# EAGLE design minutka_schematic (EAGLE 7.7.0)
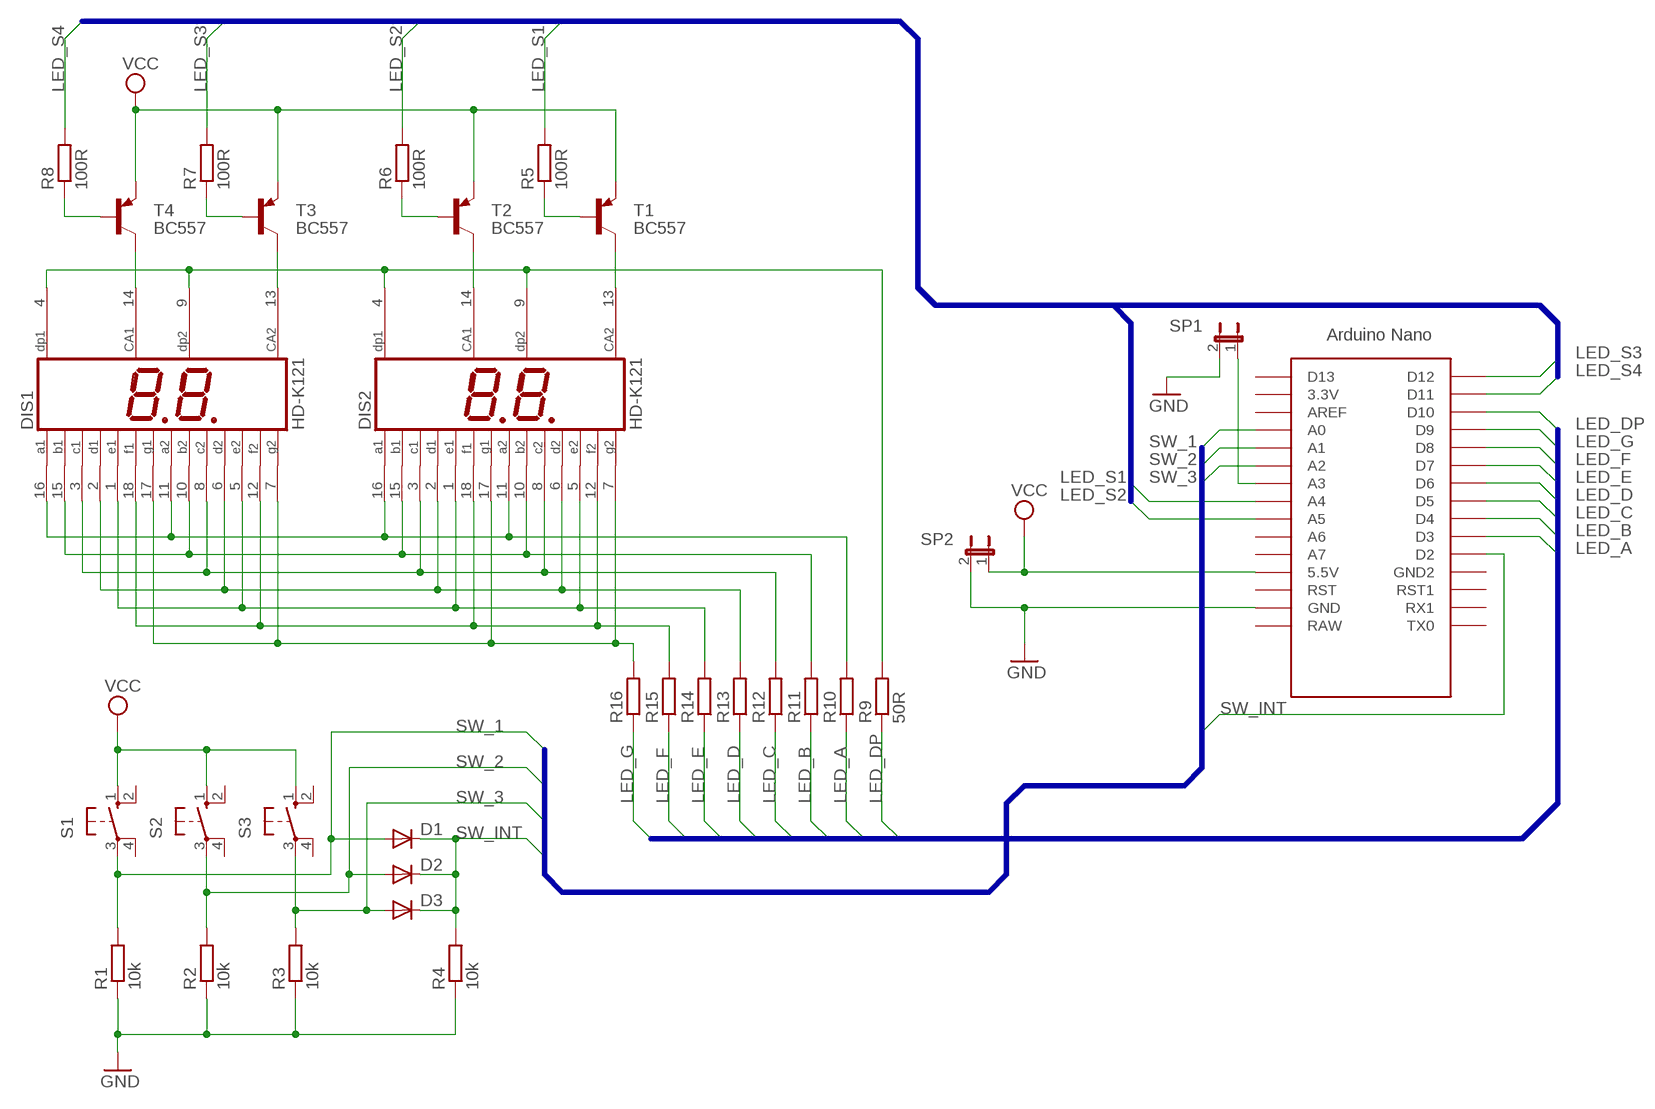
[diagram p0: schematic, sheet 1]

## Parts
D1  DIODE-D-5  [D-5]
D2  DIODE-D-5  [D-5]
D3  DIODE-D-5  [D-5]
DIS1  HD-K121  [HDSP-R]
DIS2  HD-K121  [HDSP-R]
R1  10k  R-EU_0204/7  [0204/7]
R2  10k  R-EU_0204/7  [0204/7]
R3  10k  R-EU_0204/7  [0204/7]
R4  10k  R-EU_0204/7  [0204/7]
R5  100R  R-EU_0204/7  [0204/7]
R6  100R  R-EU_0204/7  [0204/7]
R7  100R  R-EU_0204/7  [0204/7]
R8  100R  R-EU_0204/7  [0204/7]
R9  50R  R-EU_0204/7  [0204/7]
R10  R-EU_0204/7  [0204/7]
R11  R-EU_0204/7  [0204/7]
R12  R-EU_0204/7  [0204/7]
R13  R-EU_0204/7  [0204/7]
R14  R-EU_0204/7  [0204/7]
R15  R-EU_0204/7  [0204/7]
R16  R-EU_0204/7  [0204/7]
S1  10-XX  [B3F-10XX]
S2  10-XX  [B3F-10XX]
S3  10-XX  [B3F-10XX]
SP1  JP1E  [JP1]
SP2  JP1E  [JP1]
T1  BC557  [TO92-EBC]
T2  BC557  [TO92-EBC]
T3  BC557  [TO92-EBC]
T4  BC557  [TO92-EBC]
U$1  NANO  [NANO]

## Nets
GND: R1.1 R2.1 R3.1 R4.1 SP1.2 SP2.2 U$1.GND
LED_A: R10.1 U$1.D3
LED_B: R11.1 U$1.D4
LED_C: R12.1 U$1.D5
LED_D: R13.1 U$1.D6
LED_DP: R9.1 U$1.D10
LED_E: R14.1 U$1.D7
LED_F: R15.1 U$1.D8
LED_G: R16.1 U$1.D9
LED_S1: R5.2 U$1.A4
LED_S2: R6.2 U$1.A5
LED_S3: R7.2 U$1.D12
LED_S4: R8.2 U$1.D11
N$1: DIS1.11(A2) DIS1.16(A1) DIS2.11(A2) DIS2.16(A1) R10.2
N$2: DIS1.10(B2) DIS1.15(B1) DIS2.10(B2) DIS2.15(B1) R11.2
N$3: DIS1.3(C1) DIS1.8(C2) DIS2.3(C1) DIS2.8(C2) R12.2
N$4: DIS1.2(D1) DIS1.6(D2) DIS2.2(D1) DIS2.6(D2) R13.2
N$5: DIS1.1(E1) DIS1.5(E2) DIS2.1(E1) DIS2.5(E2) R14.2
N$6: DIS1.12(F2) DIS1.18(F1) DIS2.12(F2) DIS2.18(F1) R15.2
N$7: DIS1.7(G2) DIS1.17(G1) DIS2.7(G2) DIS2.17(G1) R16.2
N$8: DIS1.4(DP1) DIS1.9(DP2) DIS2.4(DP1) DIS2.9(DP2) R9.2
N$9: DIS2.13(CA2) T1.C
N$10: DIS2.14(CA1) T2.C
N$11: DIS1.13(CA2) T3.C
N$12: DIS1.14(CA1) T4.C
N$13: R7.1 T3.B
N$14: R8.1 T4.B
N$15: R6.1 T2.B
N$16: R5.1 T1.B
N$20: SP1.1 U$1.A3
SW_1: D1.A R1.2 S1.3(P) U$1.A0
SW_2: D2.A R2.2 S2.3(P) U$1.A1
SW_3: D3.A R3.2 S3.3(P) U$1.A2
SW_INT: D1.C D2.C D3.C R4.2 U$1.D2
VCC: S1.1(S) S2.1(S) S3.1(S) SP2.1 T1.E T2.E T3.E T4.E U$1.5V(5.5V)
Unconnected: S1.2(S1) S1.4(P1) S2.2(S1) S2.4(P1) S3.2(S1) S3.4(P1) U$1.3.3V U$1.A6 U$1.A7 U$1.AREF U$1.D13 U$1.GND1(GND2) U$1.ICSP1 U$1.ICSP2 U$1.ICSP3 U$1.ICSP4 U$1.ICSP5 U$1.ICSP6 U$1.RAW U$1.RST U$1.RST1 U$1.RX1 U$1.TX0

## Buses
LED_A,LED_B,LED_C,LED_D,LED_E,LED_F,LED_G,LED_DP
SW_1,SW_2,SW_3,SW_INT
LED_S1,LED_S2,LED_S3,LED_S4

## Library data of the parts
D1-D3 = diode:DIODE-: DIODE
DIS1 DIS2 = display-hp:HD-K121: LED DISPLAY 2 x 1 character 7 segment, decimal points right; OC_FARNELL: unknown; OC_NEWARK: unknown
R1-R16 = rcl:R-EU_: RESISTOR, European symbol
S1-S3 = switch-omron:10-XX: OMRON SWITCH; MPN: B3F-1000; OC_FARNELL: 176432; OC_NEWARK: 36M3542
SP1 SP2 = jumper:JP1E: JUMPER
T1-T4 = transistor-pnp:BC557*: PNP Transistror
U$1 = Arduino-clone:NANO: Arduino Nano

## Board
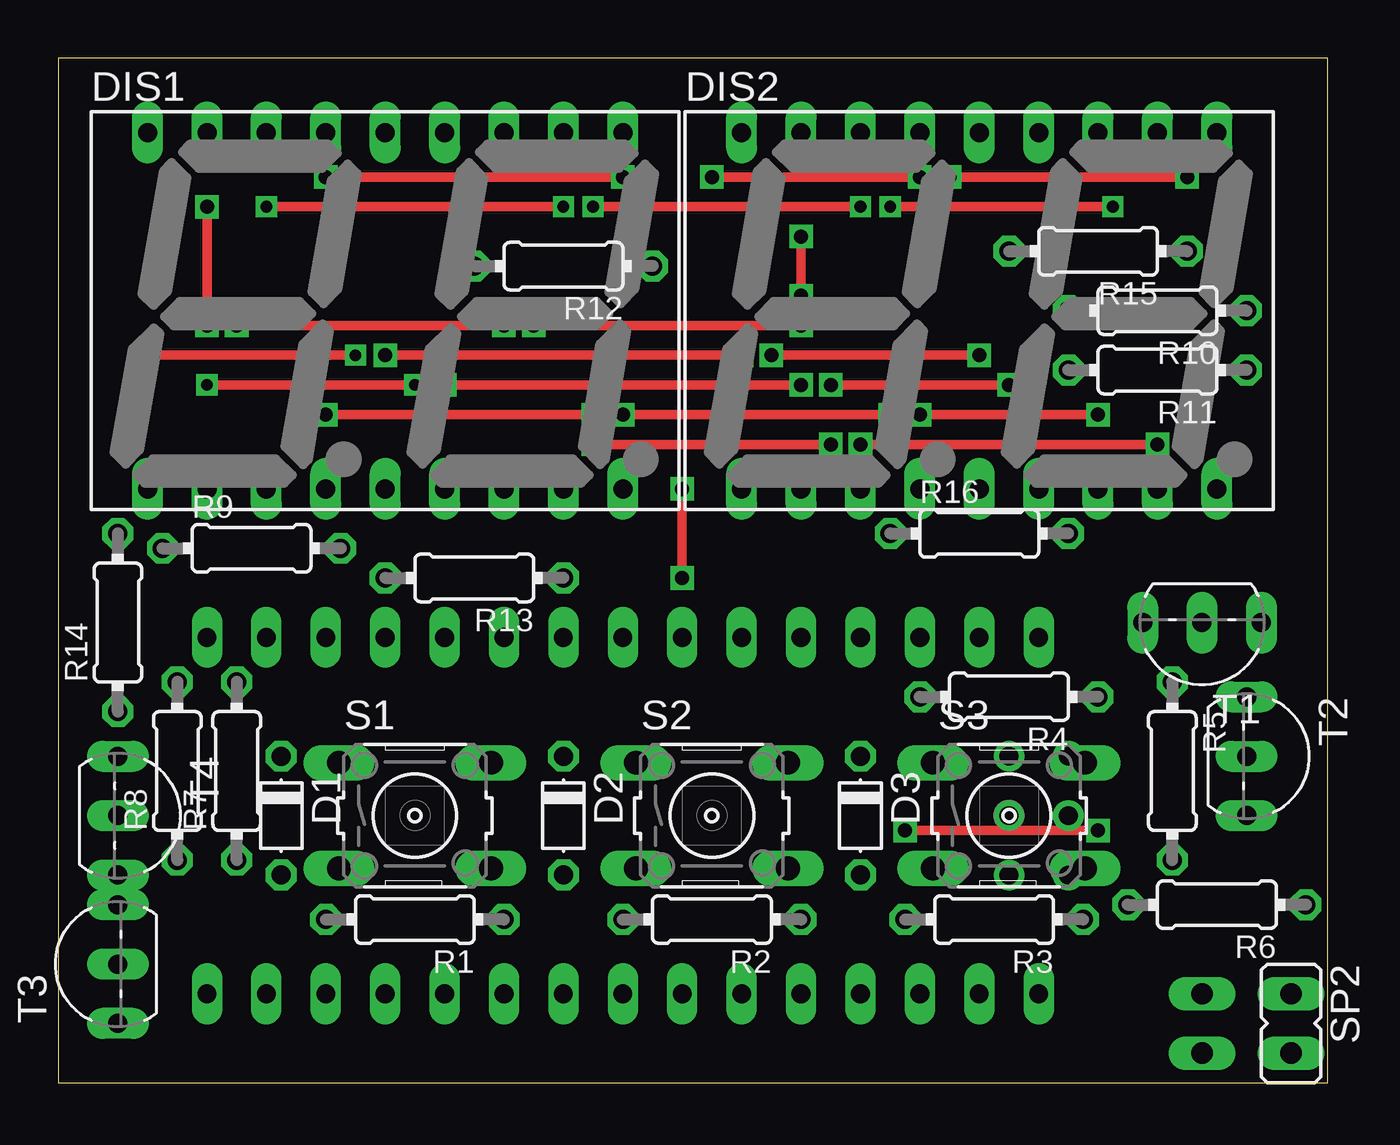
[diagram p1: board, top side]
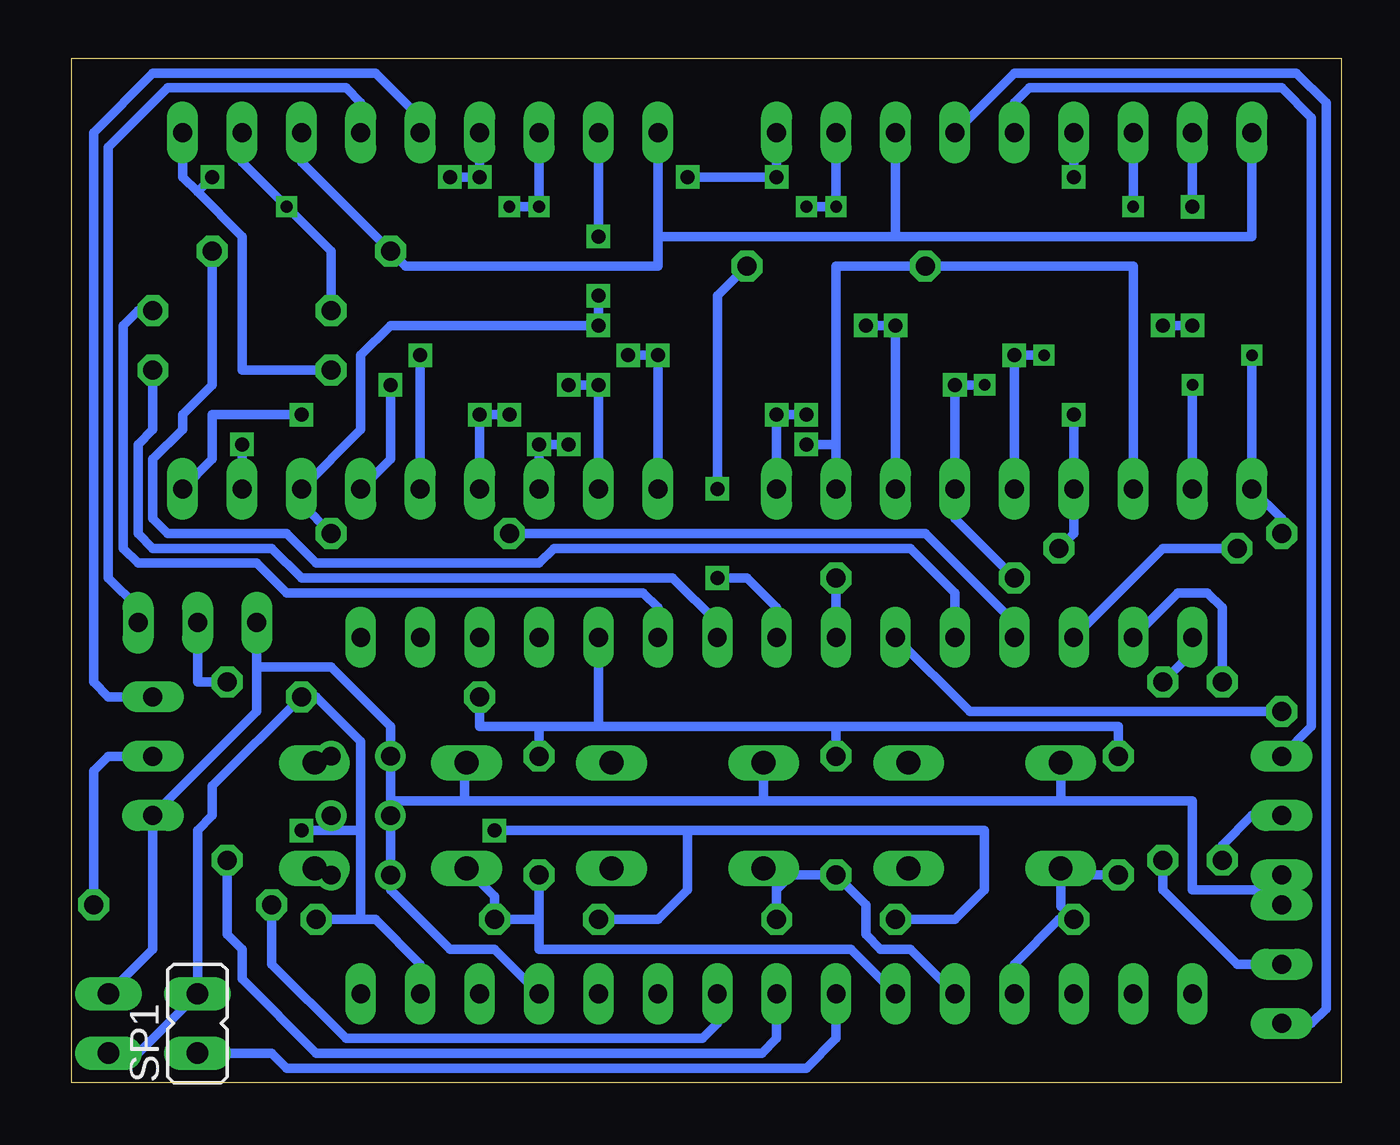
[diagram p2: board, bottom side, seen from below]

Size 54.28 x 43.8 mm. Coordinates in mm from the lower left corner, seen from the top.
Outline: 0,0 54.28,0 54.28,43.8 0,43.8 0,0
Copper layers (1*16): Top 0.035mm / dielectric 1.5mm / Bottom 0.035mm
Design rules "default": minimum track width 10mil, minimum drill 24mil, track to track 8mil, track to pad 8mil, pad to pad 8mil, via to via 8mil, smd to smd 8mil, copper to edge 40mil, drill to drill 8mil, minimum pad ring 10mil, minimum via ring 8mil, stop-mask expansion 4mil, vias tented up to drill 0mil, thermal gap 10mil

### Footprints (pad centres in the part's own frame; a part is rotated, then mirrored left to right if it is on the bottom)
D-5 = drill 0.813 octagon: A 2.54,0; C -2.54,0
HDSP-R = drill 0.813 long: 1 -10.16,-7.62; 2 -7.62,-7.62; 3 -5.08,-7.62; 4 -2.54,-7.62; 5 0,-7.62; 6 2.54,-7.62; 7 5.08,-7.62; 8 7.62,-7.62; 9 10.16,-7.62; 10 10.16,7.62; 11 7.62,7.62; 12 5.08,7.62; 13 2.54,7.62; 14 0,7.62; 15 -2.54,7.62; 16 -5.08,7.62; 17 -7.62,7.62; 18 -10.16,7.62
0204/7 = drill 0.813 octagon: 1 -3.81,0; 2 3.81,0
B3F-10XX = drill 1.016 long: 1 -3.251,2.261; 2 3.251,2.261; 3 -3.251,-2.261; 4 3.251,-2.261
JP1 = drill 0.914 long: 1 0,-1.27; 2 0,1.27
TO92-EBC = drill 0.813 long: B 0,-1.27; C -2.54,-1.27; E 2.54,-1.27
NANO = drill 0.8 long: 3.3V -10.16,24.13; 5V -10.16,-1.27; A0 -10.16,19.05; A1 -10.16,16.51; A2 -10.16,13.97; A3 -10.16,11.43; A4 -10.16,8.89; A5 -10.16,6.35; A6 -10.16,3.81; A7 -10.16,1.27; AREF -10.16,21.59; D2 5.08,1.27; D3 5.08,3.81; D4 5.08,6.35; D5 5.08,8.89; D6 5.08,11.43; D7 5.08,13.97; D8 5.08,16.51; D9 5.08,19.05; D10 5.08,21.59; D11 5.08,24.13; D12 5.08,26.67; D13 -10.16,26.67; GND -10.16,-6.35; GND1 5.08,-1.27; RAW -10.16,-8.89; RST -10.16,-3.81; RST1 5.08,-3.81; RX1 5.08,-6.35; TX0 5.08,-8.89 | drill 0.8: ICSP1 -5.08,-10.16; ICSP2 -5.08,-7.62; ICSP3 -2.54,-10.16; ICSP4 -2.54,-7.62; ICSP5 0,-10.16; ICSP6 0,-7.62

### Placement (x,y rotation side)
D1  9.53,11.43 270 top
D2  21.59,11.43 270 top
D3  34.29,11.43 270 top
DIS1  13.97,33.02 0 top
DIS2  39.37,33.02 0 top
R1  15.24,6.99 180 top
R2  27.94,6.99 180 top
R3  40.01,6.99 180 top
R4  40.64,16.51 180 top
R5  47.62,13.34 270 top
R6  49.53,7.62 180 top
R7  7.62,13.34 90 top
R8  5.08,13.34 90 top
R9  8.26,22.86 0 top
R10  46.99,33.02 180 top
R11  46.99,30.48 180 top
R12  21.59,34.92 180 top
R13  17.78,21.59 180 top
R14  2.54,19.68 90 top
R15  44.45,35.56 180 top
R16  39.37,23.5 0 top
S1  15.24,11.43 0 top
S2  27.94,11.43 0 top
S3  40.64,11.43 0 top
SP1  48.9,2.54 0 bottom
SP2  52.7,2.54 180 top
T1  48.9,18.41 180 top
T2  52.07,13.97 270 top
T3  1.27,5.08 90 top
T4  3.81,11.43 270 top
U$1  33.02,13.97 90 top

### Tracks (layer width: path | path; a pad name or v marks a point on that pad's centre or on a via)
GND  (via drill 0.6 pad 0.25)
  Top 0.406: v36.2,10.79 v44.45,10.79
  Bottom 0.406: U$1.GND 39.37,5.08 41.27,6.99 41.91,6.99 | 41.91,6.99 R3.1 | 41.91,10.79 41.91,14.61 43.81,16.51 R4.1 48.26,12.7 48.26,11.43 48.9,10.79 SP1.2 51.44,1.27 SP2.2 | 41.91,10.79 41.91,6.99 | R1.1 16.51,6.99 15.24,8.26 15.24,10.79 27.94,10.79 | R2.1 29.21,6.99 27.94,8.26 27.94,10.79 | 27.94,10.79 v36.2,10.79 | v44.45,10.79 41.91,10.79
LED_A
  Bottom 0.406: U$1.D3 29.21,20.32 29.84,20.95 45.09,20.95 46.35,22.23 51.44,22.23 52.07,22.86 52.07,32.38 51.44,33.02 R10.1
LED_B
  Bottom 0.406: R11.1 50.8,27.94 51.44,27.3 51.44,23.5 50.8,22.86 45.72,22.86 44.45,21.59 28.57,21.59 26.67,19.68 U$1.D4
LED_C  (via drill 0.6)
  Top 0.406: v26.67,21.59 v26.67,25.4
  Bottom 0.406: U$1.D5 24.13,20.32 25.4,21.59 v26.67,21.59 | v26.67,25.4 26.67,33.66 R12.1
LED_D
  Bottom 0.406: U$1.D6 R13.1
LED_DP
  Bottom 0.406: U$1.D10 7.62,22.86 R9.1
LED_E
  Bottom 0.406: R14.1 15.88,15.88 U$1.D7
LED_F
  Bottom 0.406: U$1.D8 16.51,20.95 18.41,22.86 33.66,22.86 34.29,22.23 43.81,22.23 45.09,23.5 50.16,23.5 50.8,24.13 50.8,26.67 49.53,27.94 49.53,28.57 48.26,29.84 R15.1
LED_G
  Bottom 0.406: U$1.D9 13.97,19.68 17.78,23.5 R16.1
LED_S1
  Bottom 0.406: U$1.A4 24.13,1.91 24.77,1.27 43.81,1.27 46.99,4.45 46.99,5.71 47.62,6.35 R5.2
LED_S2
  Bottom 0.406: U$1.A5 26.67,2.54 27.3,1.91 42.55,1.91 45.72,5.08 R6.2
LED_S3
  Bottom 0.406: U$1.D12 6.35,18.41 R7.2
LED_S4
  Bottom 0.406: U$1.D11 6.99,20.95 5.71,20.95 5.08,20.32 R8.2
N$1  (via drill 0.5)
  Top 0.406: v8.89,37.47 v21.59,37.47 | v22.86,37.47 v34.29,37.47 | v35.56,37.47 v45.09,37.47
  Bottom 0.406: DIS1.16 v8.89,37.47 | DIS1.11 v21.59,37.47 v22.86,37.47 | DIS2.16 v34.29,37.47 v35.56,37.47 | DIS2.11 46.99,39.37 v45.09,37.47 43.18,35.56 R10.2
N$2  (via drill 0.6 pad 0.25)
  Top 0.406: v11.43,38.73 v24.13,38.73 | v27.94,38.73 v36.83,38.73 | v38.1,38.73 v48.26,38.73
  Bottom 0.406: R11.2 46.99,30.48 46.99,36.2 48.9,38.1 | 48.9,38.1 49.53,38.73 DIS2.10 | DIS1.15 v11.43,38.73 | DIS1.10 v24.13,38.73 v27.94,38.73 | DIS2.15 v36.83,38.73 v38.1,38.73 | v48.26,38.73 48.9,38.1
N$3  (via drill 0.6)
  Top 0.406: v46.99,27.3 v34.29,27.3 | v33.02,27.3 v22.86,27.3
  Bottom 0.406: DIS1.8 21.59,27.3 | 21.59,27.3 21.59,34.92 R12.2 8.89,34.92 DIS1.3 | DIS2.8 v46.99,27.3 | DIS2.3 v34.29,27.3 v33.02,27.3 | v22.86,27.3 21.59,27.3
N$4  (via drill 0.5, 0.6 pad 0.25)
  Top 0.406: v40.64,29.84 v33.02,29.84 | v31.75,29.84 v16.51,29.84 | v15.24,29.84 v6.35,29.84
  Bottom 0.406: DIS2.6 40.64,26.67 v40.64,29.84 | v33.02,29.84 v31.75,29.84 DIS2.2 | v15.24,29.84 v16.51,29.84 DIS1.6 16.51,24.13 R13.2 | v6.35,29.84 DIS1.2
N$5  (via drill 0.5, 0.6 pad 0.25)
  Top 0.406: v13.97,31.11 v29.21,31.11 | v39.37,31.11 v30.48,31.11 | v12.7,31.11 v3.81,31.11
  Bottom 0.406: DIS1.5 v13.97,31.11 v12.7,31.11 | DIS2.1 v29.21,31.11 v30.48,31.11 | DIS2.5 v39.37,31.11 | R14.2 2.54,24.13 DIS1.1 v3.81,31.11
N$6
  Bottom 0.406: DIS1.18 3.81,36.2 19.05,36.2 | DIS1.12 19.05,36.2 | 19.05,36.2 29.21,36.2 | DIS2.18 29.21,36.2 | 29.21,36.2 29.21,34.92 40.01,34.92 R15.2 44.45,39.37 DIS2.12
N$7  (via drill 0.6)
  Top 0.406: v6.35,37.47 v6.35,32.38 | v7.62,32.38 v19.05,32.38 | v20.32,32.38 v31.75,32.38 | v31.75,33.66 v31.75,36.2
  Bottom 0.406: R16.2 44.45,24.77 DIS2.7 41.91,27.94 41.91,31.11 40.64,32.38 v31.75,32.38 v31.75,33.66 | DIS1.17 v6.35,37.47 | v6.35,32.38 v7.62,32.38 | DIS1.7 v19.05,32.38 v20.32,32.38 | v31.75,36.2 DIS2.17
N$8  (via drill 0.6 pad 0.25)
  Top 0.406: v35.56,28.57 v24.13,28.57 | v22.86,28.57 v11.43,28.57 | v44.45,28.57 v36.83,28.57
  Bottom 0.406: DIS2.4 v36.83,28.57 v35.56,28.57 | DIS1.9 v24.13,28.57 v22.86,28.57 | v11.43,28.57 DIS1.4 11.43,23.5 R9.2 | DIS2.9 48.26,26.67 48.26,28.57 v44.45,28.57
N$9
  Bottom 0.406: DIS2.13 41.91,41.91 42.55,42.55 50.16,42.55 52.7,40.01 52.7,21.59 51.44,20.32 T1.C
N$10
  Bottom 0.406: DIS2.14 39.37,41.27 41.27,43.18 50.8,43.18 53.34,40.64 53.34,17.14 52.7,16.51 T2.C
N$11
  Bottom 0.406: DIS1.13 13.97,43.18 1.91,43.18 0.64,41.91 0.64,3.17 1.27,2.54 T3.C
N$12
  Bottom 0.406: DIS1.14 13.97,41.91 13.34,42.55 2.54,42.55 1.27,41.27 1.27,15.24 T4.C
N$13
  Bottom 0.406: T3.B 4.45,5.08 7.62,8.26 R7.1
N$14
  Bottom 0.406: T4.B 3.81,11.43 5.08,10.16 R8.1
N$15
  Bottom 0.406: T2.B 52.7,13.97 53.34,13.34 R6.1
N$16
  Bottom 0.406: T1.B 48.9,17.14 R5.1
N$20
  Bottom 0.406: U$1.A3 21.59,1.91 22.86,0.64 45.09,0.64 45.72,1.27 SP1.1
SW_1
  Bottom 0.406: U$1.A0 13.97,5.08 12.06,6.99 R1.2 11.99,7.54 S1.3 11.71,8.89 D1.A
SW_2
  Bottom 0.406: U$1.A1 18.41,5.71 19.68,5.71 20.32,6.35 20.32,7.62 D2.A 23.5,8.89 24.13,8.26 | R2.2 24.13,8.26 | 24.13,8.26 24.13,8.61 S2.3
SW_3
  Bottom 0.406: U$1.A2 20.95,5.71 34.29,5.71 34.29,6.99 | 34.29,6.99 D3.A | 34.29,6.99 R3.2 36.2,7.98 S3.3
SW_INT
  Bottom 0.406: D1.C 9.53,15.24 21.59,15.24 | D2.C 21.59,15.24 | 21.59,15.24 31.75,15.24 | 31.75,15.24 U$1.D2 | D3.C 34.29,15.24 | 34.29,15.24 31.75,15.24 | 34.29,15.24 36.83,15.24 R4.2
VCC
  Bottom 0.406: T3.E 2.54,8.26 | 2.54,8.26 T4.E | 46.35,17.78 46.35,15.88 T2.E 50.8,5.71 SP2.1 | T1.E 46.35,17.78 | 46.35,17.78 43.18,17.78 40.64,15.24 40.64,12.06 | S1.1 11.99,12.06 | 11.99,12.06 24.69,12.06 | 24.69,12.06 37.47,12.06 | 37.47,12.06 37.47,13.69 S3.1 | S2.1 24.69,12.06 | 11.99,12.06 6.35,12.06 6.35,8.26 2.54,8.26 | U$1.5V 36.2,5.71 38.1,5.71 40.64,8.26 40.64,12.06 | 40.64,12.06 37.47,12.06